# Altium schematic sheet power.SchDoc: Power Supply
size A3; DocumentNumber: 4; SheetNumber: 4; SheetTotal: 9
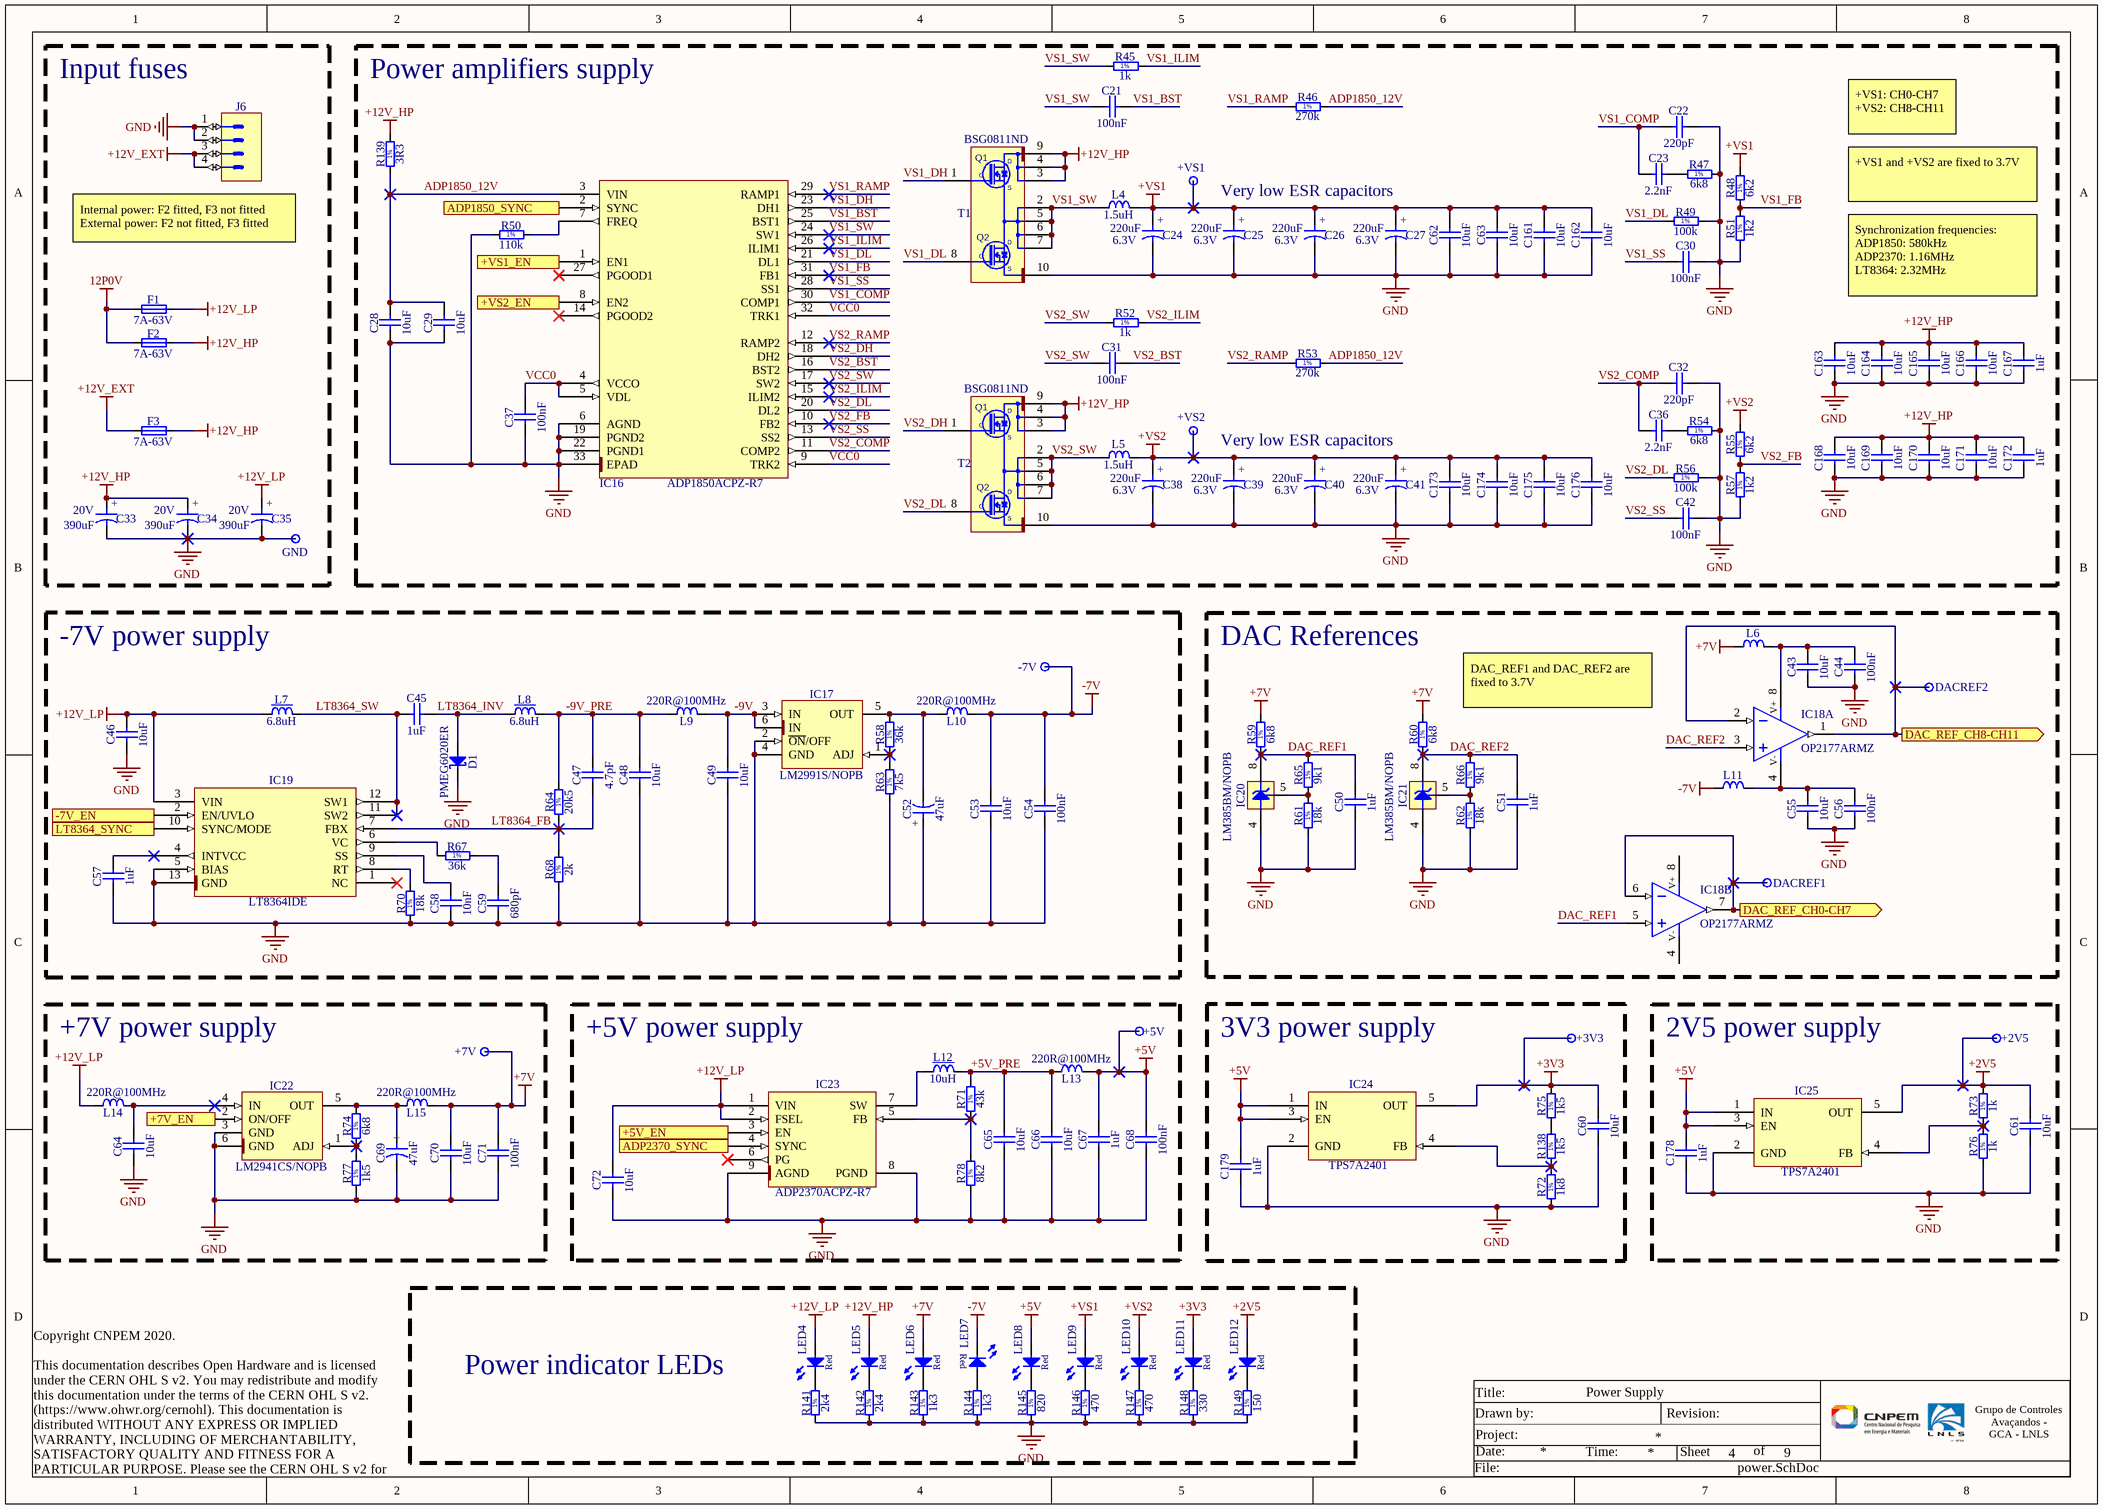
[diagram p0: power.SchDoc]

## Parts
+2V5  Test Point  [TPS127]  (value not drawn)
+3V3  Test Point  [TPS127]  (value not drawn)
+5V  Test Point  [TPS127]  (value not drawn)
+7V  Test Point  [TPS127]  (value not drawn)
+VS1  Test Point  [TPS127]  (value not drawn)
+VS2  Test Point  [TPS127]  (value not drawn)
-7V  Test Point  [TPS127]  (value not drawn)
C21  100nF  [CAPC1005X55N]
C22  220pF  [CAPC1005X55N]
C23  2.2nF  [CAPC1005X55N]
C24  220uF  Voltage: 6.3V  [CAPMP7343X310N]
C25  220uF  Voltage: 6.3V  [CAPMP7343X310N]
C26  220uF  Voltage: 6.3V  [CAPMP7343X310N]
C27  220uF  Voltage: 6.3V  [CAPMP7343X310N]
C28  10uF  [CAPC3216X180N]
C29  10uF  [CAPC3216X180N]
C30  100nF  [CAPC1005X55N]
C31  100nF  [CAPC1005X55N]
C32  220pF  [CAPC1005X55N]
C33  390uF  Voltage: 20V  [CAPAE830X1020N]
C34  390uF  Voltage: 20V  [CAPAE830X1020N]
C35  390uF  Voltage: 20V  [CAPAE830X1020N]
C36  2.2nF  [CAPC1005X55N]
C37  100nF  [CAPC1005X55N]
C38  220uF  Voltage: 6.3V  [CAPMP7343X310N]
C39  220uF  Voltage: 6.3V  [CAPMP7343X310N]
C40  220uF  Voltage: 6.3V  [CAPMP7343X310N]
C41  220uF  Voltage: 6.3V  [CAPMP7343X310N]
C42  100nF  [CAPC1005X55N]
C43  10uF  [CAPC2012X95N]
C44  100nF  [CAPC1608X87N]
C45  1uF  [CAPC2012X140N]
C46  10uF  [CAPC3216X180N]
C47  4.7pF  [CAPC1005X55N]
C48  10uF  [CAPC3216X180N]
C49  10uF  [CAPC3216X180N]
C50  1uF  [CAPC2012X135N]
C51  1uF  [CAPC2012X135N]
C52  47uF  [CAPMP7343X310N]
C53  10uF  [CAPC3216X180N]
C54  100nF  [CAPC1608X87N]
C55  10uF  [CAPC2012X95N]
C56  100nF  [CAPC1608X87N]
C57  1uF  [CAPC2012X140N]
C58  10nF  [CAPC1005X55N]
C59  680pF  [CAPC1005X55N]
C60  10uF  [CAPC2012X95N]
C61  10uF  [CAPC2012X95N]
C62  10uF  [CAPC3216X180N]
C63  10uF  [CAPC3216X180N]
C64  10uF  [CAPC3216X180N]
C65  10uF  [CAPC3216X180N]
C66  10uF  [CAPC3216X180N]
C67  1uF  [CAPC2012X135N]
C68  100nF  [CAPC1005X55N]
C69  47uF  [CAPMP7343X310N]
C70  10uF  [CAPC3216X180N]
C71  100nF  [CAPC1608X87N]
C72  10uF  [CAPC3216X180N]
C161  10uF  [CAPC3216X180N]
C162  10uF  [CAPC3216X180N]
C163  10uF  [CAPC3216X180N]
C164  10uF  [CAPC3216X180N]
C165  10uF  [CAPC3216X180N]
C166  10uF  [CAPC3216X180N]
C167  1uF  [CAPC2012X135N]
C168  10uF  [CAPC3216X180N]
C169  10uF  [CAPC3216X180N]
C170  10uF  [CAPC3216X180N]
C171  10uF  [CAPC3216X180N]
C172  1uF  [CAPC2012X135N]
C173  10uF  [CAPC3216X180N]
C174  10uF  [CAPC3216X180N]
C175  10uF  [CAPC3216X180N]
C176  10uF  [CAPC3216X180N]
C178  1uF  [CAPC2012X135N]
C179  1uF  [CAPC2012X135N]
D1  PMEG6020ER  [SODFL3517X110N]
DACREF1  Test Point  [TPS127]  (value not drawn)
DACREF2  Test Point  [TPS127]  (value not drawn)
F1  7A-63V  [FUSC_BEL_C1T_1206]
F2  7A-63V  [FUSC_BEL_C1T_1206]
F3  7A-63V  [FUSC_BEL_C1T_1206]
GND  Test Point  [TPS127]  (value not drawn)
IC16  ADP1850ACPZ-R7  [QFN50P500X500X100-33N-S325]
IC17  LM2991S/NOPB  [TO170P1435X465-6N-R1041X635]
IC18  OP2177ARMZ  [SOP65P490X110-8N]  (parts A,B of 2)
IC19  LT8364IDE  [DFN50P300X400-12N-1]
IC20  LM385BM/NOPB  [SOIC127P600X175-8N]
IC21  LM385BM/NOPB  [SOIC127P600X175-8N]
IC22  LM2941CS/NOPB  [TO170P1435X465-6N-R1041X635]
IC23  ADP2370ACPZ-R7  [SON50P300X300X80-9N-R170X244]
IC24  TPS7A2401  [SOT95P270X145-5N]
IC25  TPS7A2401  [SOT95P270X145-5N]
J6  Euroblock  [MOLEX_39502-1004]  (value not drawn)
L4  1.5uH  [IND_PULSE_PA4342_FP1]
L5  1.5uH  [IND_PULSE_PA4342_FP1]
L6  1K@100MHz  [INDC1608X95N]  (value not drawn)
L7  6.8uH  [IND_BOURNS_SRN5040TA]
L8  6.8uH  [IND_BOURNS_SRN5040TA]
L9  220R@100MHz  [INDC2012X105N]
L10  220R@100MHz  [INDC2012X105N]
L11  1K@100MHz  [INDC1608X95N]  (value not drawn)
L12  10uH  [IND_BOURNS_SRN5040TA]
L13  220R@100MHz  [INDC2012X105N]
L14  220R@100MHz  [INDC2012X105N]
L15  220R@100MHz  [INDC2012X105N]
LED4  Red  [LEDC1608X80N_RED]  (value not drawn)
LED5  Red  [LEDC1608X80N_RED]  (value not drawn)
LED6  Red  [LEDC1608X80N_RED]  (value not drawn)
LED7  Red  [LEDC1608X80N_RED]  (value not drawn)
LED8  Red  [LEDC1608X80N_RED]  (value not drawn)
LED9  Red  [LEDC1608X80N_RED]  (value not drawn)
LED10  Red  [LEDC1608X80N_RED]  (value not drawn)
LED11  Red  [LEDC1608X80N_RED]  (value not drawn)
LED12  Red  [LEDC1608X80N_RED]  (value not drawn)
R45  1k  [RESC1005X40N]
R46  270k  [RESC1005X40N]
R47  6k8  [RESC1005X40N]
R48  6k2  [RESC2012X60N]
R49  100k  [RESC1005X40N]
R50  110k  [RESC1005X40N]
R51  1k2  [RESC2012X60N]
R52  1k  [RESC1005X40N]
R53  270k  [RESC1005X40N]
R54  6k8  [RESC1005X40N]
R55  6k2  [RESC2012X60N]
R56  100k  [RESC1005X40N]
R57  1k2  [RESC2012X60N]
R58  36k  [RESC1005X40N]
R59  6k8  [RESC1005X40N]
R60  6k8  [RESC1005X40N]
R61  18k  [RESC2012X60N]
R62  18k  [RESC2012X60N]
R63  7k5  [RESC1005X40N]
R64  20k5  [RESC1005X40N]
R65  9k1  [RESC2012X60N]
R66  9k1  [RESC2012X60N]
R67  36k  [RESC1005X40N]
R68  2k  [RESC1005X40N]
R70  18k  [RESC1005X40N]
R71  43k  [RESC1005X40N]
R72  1k8  [RESC1005X40N]
R73  1k  [RESC1005X40N]
R74  6k8  [RESC1005X40N]
R75  1k5  [RESC1005X40N]
R76  1k  [RESC1005X40N]
R77  1k5  [RESC1005X40N]
R78  8k2  [RESC1005X40N]
R138  1k5  [RESC1005X40N]
R139  3R3  [RESC2012X60N]
R141  2k4  [RESC1005X40N]
R142  2k4  [RESC1005X40N]
R143  1k3  [RESC1005X40N]
R144  1k3  [RESC1005X40N]
R145  820  [RESC1005X40N]
R146  470  [RESC1005X40N]
R147  470  [RESC1005X40N]
R148  330  [RESC1005X40N]
R149  150  [RESC1005X40N]
T1  BSG0811ND  [PG-TISON8-4]
T2  BSG0811ND  [PG-TISON8-4]

## Blocks framed on the sheet
Input fuses: C33-C35 F1-F3 GND J6
Power amplifiers supply: +VS1 +VS2 C21-C32 C36-C42 C62 C63 C161-C176 IC16 L4 L5 R45-R57 R139 T1 T2
-7V power supply: -7V C45-C49 C52-C54 C57-C59 D1 IC17 IC19 L7-L10 R58 R63 R64 R67 R68 R70
DAC References: C43 C44 C50 C51 C55 C56 DACREF1 DACREF2 IC18 IC20 IC21 L6 L11 R59-R62 R65 R66
+7V power supply: +7V C64 C69-C71 IC22 L14 L15 R74 R77
+5V power supply: +5V C65-C68 C72 IC23 L12 L13 R71 R78
3V3 power supply: +3V3 C60 C179 IC24 R72 R75 R138
2V5 power supply: +2V5 C61 C178 IC25 R73 R76
Power indicator LEDs: LED4-LED12 R141-R149

## Ports
+5V_EN (in), +7V_EN (in), +VS1_EN (in), +VS2_EN (in), -7V_EN (in), ADP1850_SYNC (in), ADP2370_SYNC (in), DAC_REF_CH0-CH7 (out), DAC_REF_CH8-CH11 (out), LT8364_SYNC (in)

## Nets
12P0V: F1.1 F2.1
+2V5: +2V5.1 C61.2 IC25.5(OUT) LED12.2(A) R73.2
+3V3: +3V3.1 C60.2 IC24.5(OUT) LED11.2(A) R75.2
+5V: +5V.1 C67.2 C68.2 C178.2 C179.2 IC24.1(IN) IC24.3(EN) IC25.1(IN) IC25.3(EN) L13.2 LED8.2(A)
+7V: +7V.1 C70.2 C71.2 L6.1 L15.2 LED6.2(A) R59.2 R60.2
+12V_EXT: F3.1 J6.3 J6.4
+12V_HP: C33.1 C34.1 C163.2 C164.2 C165.2 C166.2 C167.2 C168.2 C169.2 C170.2 C171.2 C172.2 F2.2 F3.2 LED5.2(A) R139.2 T1.3(D1) T1.4(S2) T1.9(D1) T2.3(D1) T2.4(S2) T2.9(D1)
+12V_LP: C35.1 C46.2 C72.2 F1.2 IC19.3(VIN) IC23.1(VIN) IC23.2(FSEL) L7.1 L14.1 LED4.2(A)
+VS1: +VS1.1 C24.1 C25.1 C26.1 C27.1 C62.2 C63.2 C161.2 C162.2 L4.2 LED9.2(A) R48.2
+VS2: +VS2.1 C38.1 C39.1 C40.1 C41.1 C173.2 C174.2 C175.2 C176.2 L5.2 LED10.2(A) R55.2
-7V: -7V.1 C53.2 C54.2 L10.2 L11.1 LED7.1(C)
GND: C22.2 C24.2 C25.2 C26.2 C27.2 C28.1 C29.1 C30.2 C32.2 C33.2 C34.2 C35.2 C37.1 C38.2 C39.2 C40.2 C41.2 C42.2 C43.1 C44.1 C46.1 C48.1 C49.1 C50.1 C51.1 C52.1 C53.1 C54.1 C55.1 C56.1 C57.1 C58.1 C59.1 C60.1 C61.1 C62.1 C63.1 C64.1 C65.1 C66.1 C67.1 C68.1 C69.2 C70.1 C71.1 C72.1 C161.1 C162.1 C163.1 C164.1 C165.1 C166.1 C167.1 C168.1 C169.1 C170.1 C171.1 C172.1 C173.1 C174.1 C175.1 C176.1 C178.1 C179.1 D1.1(C) GND.1 IC16.6(AGND) IC16.19(PGND2) IC16.22(PGND1) IC16.33(EPAD) IC17.2(~{ON}/OFF) IC17.4(GND) IC19.5(BIAS) IC19.13(GND) IC20.4(A) IC21.4(A) IC22.3(GND) IC22.6(GND) IC23.8(PGND) IC23.9(AGND) IC24.2(GND) IC25.2(GND) J6.1 J6.2 R47.2 R49.2 R50.1 R51.1 R54.2 R56.2 R57.1 R61.1 R62.1 R63.1 R68.1 R70.1 R72.1 R76.1 R77.1 R78.1 R141.1 R142.1 R143.1 R144.1 R145.1 R146.1 R147.1 R148.1 R149.1 T1.10(S2) T2.10(S2)
+5V_EN: IC23.3(EN) ; port +5V_EN
+5V_PRE: C65.2 C66.2 L12.2 L13.1 R71.2
+7V_EN: IC22.2(ON/OFF) ; port +7V_EN
+VS1_EN: IC16.1(EN1) ; port +VS1_EN
+VS2_EN: IC16.8(EN2) ; port +VS2_EN
-7V_EN: IC19.2(EN/UVLO) ; port -7V_EN
-9V: C49.2 IC17.3(IN) IC17.6(IN) L9.2
-9V_PRE: C47.2 C48.2 L8.2 L9.1 R64.2
ADP1850_12V: C28.2 C29.2 IC16.3(VIN) R46.2 R53.2 R139.1
ADP1850_SYNC: IC16.2(SYNC) ; port ADP1850_SYNC
ADP2370_SYNC: IC23.4(SYNC) ; port ADP2370_SYNC
DAC_REF1: C50.2 IC18.5(IN+) IC20.8(C) R59.1 R65.2
DAC_REF2: C51.2 IC18.3(IN+) IC21.8(C) R60.1 R66.2
DAC_REF_CH0-CH7: DACREF1.1 IC18.6(IN-) IC18.7(OUT) ; port DAC_REF_CH0-CH7
DAC_REF_CH8-CH11: DACREF2.1 IC18.1(OUT) IC18.2(IN-) ; port DAC_REF_CH8-CH11
LT8364_FB: C47.1 IC19.7(FBX) R64.1 R68.2
LT8364_INV: C45.2 D1.2(A) L8.1
LT8364_SW: C45.1 IC19.11(SW2) IC19.12(SW1) L7.2
LT8364_SYNC: IC19.10(SYNC/MODE) ; port LT8364_SYNC
VCC0: C37.2 IC16.4(VCCO) IC16.5(VDL) IC16.9(TRK2) IC16.32(TRK1)
VS1_BST: C21.2 IC16.25(BST1)
VS1_COMP: C22.1 C23.1 IC16.30(COMP1)
VS1_DH: IC16.23(DH1) T1.1(G1)
VS1_DL: IC16.21(DL1) R49.1 T1.8(G2)
VS1_FB: IC16.31(FB1) R48.1 R51.2
VS1_ILIM: IC16.26(ILIM1) R45.2
VS1_RAMP: IC16.29(RAMP1) R46.1
VS1_SS: C30.1 IC16.28(SS1)
VS1_SW: C21.1 IC16.24(SW1) L4.1 R45.1 T1.2(D1) T1.5(D1) T1.6(S1D2) T1.7(S2)
VS2_BST: C31.2 IC16.16(BST2)
VS2_COMP: C32.1 C36.1 IC16.11(COMP2)
VS2_DH: IC16.18(DH2) T2.1(G1)
VS2_DL: IC16.20(DL2) R56.1 T2.8(G2)
VS2_FB: IC16.10(FB2) R55.1 R57.2
VS2_ILIM: IC16.15(ILIM2) R52.2
VS2_RAMP: IC16.12(RAMP2) R53.1
VS2_SS: C42.1 IC16.13(SS2)
VS2_SW: C31.1 IC16.17(SW2) L5.1 R52.1 T2.2(D1) T2.5(D1) T2.6(S1D2) T2.7(S2)
NetC23_2: C23.2 R47.1
NetC36_2: C36.2 R54.1
NetC43_2: C43.2 C44.2 IC18.8(V+) L6.2
NetC52_2: C52.2 IC17.5(OUT) L10.1 R58.2
NetC55_2: C55.2 C56.2 IC18.4(V-) L11.2
NetC57_2: C57.2 IC19.4(INTVCC)
NetC58_2: C58.2 IC19.9(SS)
NetC59_2: C59.2 R67.2
NetC64_2: C64.2 IC22.4(IN) L14.2
NetC69_1: C69.1 IC22.5(OUT) L15.1 R74.2
NetIC16_7: IC16.7(FREQ) R50.2
NetIC17_1: IC17.1(ADJ) R58.1 R63.2
NetIC19_6: IC19.6(VC) R67.1
NetIC19_8: IC19.8(RT) R70.2
NetIC20_5: IC20.5(Adj) R61.2 R65.1
NetIC21_5: IC21.5(Adj) R62.2 R66.1
NetIC22_1: IC22.1(ADJ) R74.1 R77.2
NetIC23_5: IC23.5(FB) R71.1 R78.2
NetIC23_7: IC23.7(SW) L12.1
NetIC24_4: IC24.4(FB) R72.2 R138.1
NetIC25_4: IC25.4(FB) R73.1 R76.2
NetLED4_1: LED4.1(C) R141.2
NetLED5_1: LED5.1(C) R142.2
NetLED6_1: LED6.1(C) R143.2
NetLED7_2: LED7.2(A) R144.2
NetLED8_1: LED8.1(C) R145.2
NetLED9_1: LED9.1(C) R146.2
NetLED10_1: LED10.1(C) R147.2
NetLED11_1: LED11.1(C) R148.2
NetLED12_1: LED12.1(C) R149.2
NetR75_1: R75.1 R138.2

Not connected (* = marked no-connect by the designer): IC16 14(PGOOD2)* 27(PGOOD1)*; IC19 1(NC)*; IC23 6(PG)*

## Notes on the sheet
- +VS1: CH0-CH7
  +VS2: CH8-CH11
- (near J6) Internal power: F2 fitted, F3 not fitted
  External power: F2 not fitted, F3 fitted
- Very low ESR capacitors
- +VS1 and +VS2 are fixed to 3.7V
- Synchronization frequencies:
  ADP1850: 580kHz
  ADP2370: 1.16MHz
  LT8364: 2.32MHz
- DAC_REF1 and DAC_REF2 are fixed to 3.7V
- Title:
- Date:
- Project:
- Drawn by:
- Time:
- Revision:
- Sheet
- of
- Grupo de Controles Avaçandos -
  GCA - LNLS
- Copyright CNPEM 2020.
  This documentation describes Open Hardware and is licensed under the CERN OHL S v2. You may redistribute and modify this documentation under the terms of the CERN OHL S v2. (https://www.ohwr.org/cernohl). This documentation is distributed WITHOUT ANY EXPRESS OR IMPLIED WARRANTY, INCLUDING OF MERCHANTABILITY, SATISFACTORY QUALITY AND FITNESS FOR A PARTICULAR PURPOSE. Please see the CERN OHL S v2 for applicable conditions.
- File:
- (in symbol BSG0811ND) D; Q1; G; S; Q2
- (in symbol CAE830-1020_390UF_20V_20%_20SVPF390M) +
- (in symbol R0402_1K3_1%_0.0625W_100PPM) 1%
- (in symbol R0402_1K5_1%_0.0625W_100PPM) 1%
- (in symbol R0402_1K8_1%_0.0625W_100PPM) 1%
- (in symbol R0402_1K_1%_0.0625W_100PPM) 1%
- (in symbol R0402_2K4_1%_0.0625W_100PPM) 1%
- (in symbol R0402_2K_1%_0.0625W_100PPM) 1%
- (in symbol R0402_6K8_1%_0.0625W_100PPM) 1%
- (in symbol R0402_7K5_1%_0.0625W_100PPM) 1%
- (in symbol R0402_8K2_1%_0.0625W_100PPM) 1%
- (in symbol R0402_18K_1%_0.0625W_100PPM) 1%
- (in symbol R0402_20K5_1%_0.0625W_100PPM) 1%
- (in symbol R0402_36K_1%_0.0625W_100PPM) 1%
- (in symbol R0402_43K_1%_0.0625W_100PPM) 1%
- (in symbol R0402_100K_1%_0.0625W_100PPM) 1%
- (in symbol R0402_110K_1%_0.0625W_100PPM) 1%
- (in symbol R0402_150R_1%_0.0625W_100PPM) 1%
- (in symbol R0402_270K_1%_0.0625W_100PPM) 1%
- (in symbol R0402_330R_1%_0.0625W_100PPM) 1%
- (in symbol R0402_470R_1%_0.0625W_100PPM) 1%
- (in symbol R0402_820R_1%_0.0625W_100PPM) 1%
- (in symbol R0805_1K2_1%_0.125W_100PPM) 1%
- (in symbol R0805_3R3_1%_0.125W_200PPM) 1%
- (in symbol R0805_6K2_1%_0.125W_100PPM) 1%
- (in symbol R0805_9K1_1%_0.125W_100PPM) 1%
- (in symbol R0805_18K_1%_0.125W_100PPM) 1%
- (in symbol TANT_47uF_25V_20%_AVX_TCJD476M025R0100E) +
- (in symbol TANT_220uF_6.3V_20%_KEMET_T520D227M006ATE009) +

## Library data of the parts
+2V5 +3V3 +5V +7V +VS1 +VS2 -7V DACREF1 DACREF2 GND = SMD_PAD_1.27X1.27MM: 1.27mm x 1.27mm PCB Copper Area (SMD Test Point); Mounted: No; Part Number: SMD_PAD_1.27X1.27MM; Component Kind: Standard (No BOM); Component Type: Standard (No BOM); Pin Count: 1; Family: Test Point; Socket: No; SMD: Yes; Sense: No; Status: None; ComponentHeight: 0mm; HelpURL: Undefined; Author: CERN DEM JLC; CreateDate: 12/01/2008; LatestRevisionDate: 12/01/2008; PackageDescription: 1.27mm x 1.27mm PCB Copper Area (SMD Test Point)
C21 C30 C31 C37 C42 C68 = CC0402_100NF_16V_10%_X7R: SMD Multilayer Chip Ceramic Capacitor; Manufacturer: GENERIC; Manufacturer1 Part Number: GRM155R71C104KA88D; Voltage: 16V; TC: X7R; Tolerance: ±10%; Part Number: CC0402_100NF_16V_10%_X7R; Component Kind: Standard; Component Type: Standard; Pin Count: 2; Value: 100nF; Status: Not Recommended; Manufacturer Part Number: CC0402_100NF_16V_10%_X7R; Case: 0402; Mounted: Yes; Socket: No; SMD: Yes; Sense: No; Manufacturer1 Example: MURATA; Manufacturer1 ComponentHeight: 0.55mm; HelpURL: \\cern.ch\dfs\Applications\Altium\Datasheets\CC0402_X7R_MURATA_GRM.pdf; Author: CERN DEM JLC; CreateDate: 05/12/2013; LatestRevisionDate: 03/12/2007
C22 C32 = CC0402_220PF_50V_5%_C0G: SMD Multilayer Chip Ceramic Capacitor; Manufacturer: GENERIC; Manufacturer1 Part Number: C0402C221J5GACTU; Voltage: 50V; TC: C0G/NP0; Tolerance: ±5%; Part Number: CC0402_220PF_50V_5%_C0G; Component Kind: Standard; Component Type: Standard; Pin Count: 2; Value: 220pF; Status: Preferred; Manufacturer Part Number: CC0402_220PF_50V_5%_C0G; Case: 0402; Mounted: Yes; Socket: No; SMD: Yes; Sense: No; Manufacturer1 Example: KEMET; Manufacturer1 ComponentHeight: 0.55mm; HelpURL: \\cern.ch\dfs\Applications\Altium\Datasheets\CC0805_C0G_KEMET_(Commercial Grade).pdf; Author: CERN DEM JLC; CreateDate: 03/12/2007; LatestRevisionDate: 22/04/2015
C23 C36 = CC0402_2.2NF_50V_10%_X7R: SMD Multilayer Chip Ceramic Capacitor; Manufacturer: GENERIC; Manufacturer1 Part Number: 223858715627; Voltage: 50V; TC: X7R; Tolerance: ±10%; Part Number: CC0402_2.2NF_50V_10%_X7R; Component Kind: Standard; Component Type: Standard; Pin Count: 2; Value: 2.2nF; Status: Not Recommended; Manufacturer Part Number: CC0402_2.2NF_50V_10%_X7R; Case: 0402; Mounted: Yes; Socket: No; SMD: Yes; Sense: No; Manufacturer1 Example: PHYCOMP; Manufacturer1 ComponentHeight: 0.55mm; HelpURL: \\cern.ch\dfs\Applications\Altium\Datasheets\CC0402_X7R_PHYCOMP.pdf; Author: CERN DEM JLC; CreateDate: 03/12/2007; LatestRevisionDate: 03/12/2007
C24-C27 C38-C41 = TANT_220uF_6.3V_20%_KEMET_T520D227M006ATE009: Low ESR (9 mOhms) Organic Polymer Tantalum Capacitor (7343 Size); Manufacturer: Kemet; Tolerance: ±20%; Part Number: TANT_220uF_6.3V_20%_KEMET_T520D227M006ATE009; Component Kind: Standard; Component Type: Standard; Pin Count: 2; Value: 220uF; Status: None; Manufacturer Part Number: T520D227M006ATE009; Case: 7343; Mounted: Yes; Socket: No; SMD: Yes; Sense: No; ComponentHeight: 3mm; Author: LNLS DIG AFG; CreateDate: 21/05/2020; LatestRevisionDate: 21/05/2020
C28 C29 C46 C48 C49 C53 C62-C66 C70 C72 C161-C166 C168-C171 C173-C176 = CC1206_10UF_25V_10%_X7R: SMD Multilayer Chip Ceramic Capacitor; Manufacturer: GENERIC; Manufacturer1 Part Number: C1206C106K4RACTU; Voltage: 25V; TC: X7R; Tolerance: ±10%; Part Number: CC1206_10UF_25V_10%_X7R; Component Kind: Standard; Component Type: Standard; Pin Count: 2; Value: 10uF; Status: Preferred; Manufacturer Part Number: CC1206_10uF_25V_10%_X7R; Case: 1206; Mounted: Yes; Socket: No; SMD: Yes; Sense: No; Manufacturer1 Example: KEMET; Manufacturer1 ComponentHeight: 1.8mm; HelpURL: \\cern.ch\dfs\Applications\Altium\Datasheets\CC1206_X7R_KEMET.pdf; Author: CERN DEM JLC; CreateDate: 12/09/2012; LatestRevisionDate: 12/09/2012
C33-C35 = CAE830-1020_390UF_20V_20%_20SVPF390M: Low ESR (14 mOhms)  Aluminum Electrolytic Capacitors; Manufacturer: Panasonic; Tolerance: ±20%; Part Number: CAE830-1020_390UF_20V_20%_20SVPF390M; Component Kind: Standard; Component Type: Standard; Pin Count: 2; Value: 390uF; Status: None; Manufacturer Part Number: 20SVPF390M; Case: E12; Mounted: Yes; Socket: No; SMD: Yes; Sense: No; ComponentHeight: 12mm; Author: LNLS DIG AFG; CreateDate: 30/09/2021; LatestRevisionDate: 30/09/2021
C43 C55 C60 C61 = CC0805_10UF_25V_10%_X5R: SMD Multilayer Chip Ceramic Capacitor; Manufacturer: GENERIC; Manufacturer1 Part Number: GRM219R61E106KA12D; Voltage: 25V; TC: X5R; Tolerance: ±10%; Part Number: CC0805_10UF_25V_10%_X5R; Component Kind: Standard; Component Type: Standard; Pin Count: 2; Value: 10uF; Status: Preferred; Manufacturer Part Number: CC0805_10UF_25V_10%_X5R; Case: 0805; Mounted: Yes; Socket: No; SMD: Yes; Sense: No; Manufacturer1 Example: MURATA; Manufacturer1 ComponentHeight: 0.95mm; HelpURL: \\cern.ch\dfs\Applications\Altium\Datasheets\CC0805_X5R_MURATA_GRM.pdf; Author: CERN DEM JLC; CreateDate: 25/10/2012; LatestRevisionDate: 06/09/2016
C44 C54 C56 C71 = CC0603_100NF_50V_10%_X7R: SMD Multilayer Chip Ceramic Capacitor; Manufacturer: GENERIC; Manufacturer1 Part Number: 223858615649; Voltage: 50V; TC: X7R; Tolerance: ±10%; Part Number: CC0603_100NF_50V_10%_X7R; Component Kind: Standard; Component Type: Standard; Pin Count: 2; Value: 100nF; Status: Preferred; Manufacturer Part Number: CC0603_100NF_50V_10%_X7R; Case: 0603; Mounted: Yes; Socket: No; SMD: Yes; Sense: No; Manufacturer1 Example: PHYCOMP; Manufacturer1 ComponentHeight: 0.87mm; HelpURL: \\cern.ch\dfs\Applications\Altium\Datasheets\CC0603_X7R_PHYCOMP.pdf; Author: CERN DEM JLC; CreateDate: 03/12/2007; LatestRevisionDate: 03/12/2007
C45 C57 = CC0805_1UF_25V_10%_X7R: SMD Multilayer Chip Ceramic Capacitor; Manufacturer: GENERIC; Manufacturer1 Part Number: C0805C105K3RAC; Voltage: 25V; TC: X7R; Tolerance: ±10%; Part Number: CC0805_1UF_25V_10%_X7R; Component Kind: Standard; Component Type: Standard; Pin Count: 2; Value: 1uF; Status: Preferred; Manufacturer Part Number: CC0805_1UF_25V_10%_X7R; Case: 0805; Mounted: Yes; Socket: No; SMD: Yes; Sense: No; Manufacturer1 Example: KEMET; Manufacturer1 ComponentHeight: 1.4mm; HelpURL: \\cern.ch\dfs\Applications\Altium\Datasheets\CC0805_X7R_KEMET.pdf; Author: CERN DEM JLC; CreateDate: 23/03/2009; LatestRevisionDate: 23/03/2009
C47 = CC0402_4.7PF_50V_0.25PF_C0G: SMD Multilayer Chip Ceramic Capacitor; Manufacturer: GENERIC; Manufacturer1 Part Number: C0402C479C5GACTU; Voltage: 50V; TC: C0G/NP0; Tolerance: ±0.25pF; Part Number: CC0402_4.7PF_50V_0.25PF_C0G; Component Kind: Standard; Component Type: Standard; Pin Count: 2; Value: 4.7pF; Status: Preferred; Manufacturer Part Number: CC0402_4.7PF_50V_0.25PF_C0G; Case: 0402; Mounted: Yes; Socket: No; SMD: Yes; Sense: No; Manufacturer1 Example: KEMET; Manufacturer1 ComponentHeight: 0.55mm; HelpURL: \\cern.ch\dfs\Applications\Altium\Datasheets\CC0805_C0G_KEMET_(Commercial Grade).pdf; Author: CERN DEM JLC; CreateDate: 03/12/2007; LatestRevisionDate: 22/04/2015
C50 C51 C67 C167 C172 C178 C179 = CC0805_1UF_16V_10%_X7R: SMD Multilayer Chip Ceramic Capacitor; Manufacturer: GENERIC; Manufacturer1 Part Number: C2012X7R1C105K125AA; Voltage: 16V; TC: X7R; Tolerance: ±10%; Part Number: CC0805_1UF_16V_10%_X7R; Component Kind: Standard; Component Type: Standard; Pin Count: 2; Value: 1uF; Status: Preferred; Manufacturer Part Number: CC0805_1UF_16V_10%_X7R; Case: 0805; Mounted: Yes; Socket: No; SMD: Yes; Sense: No; Manufacturer1 Example: TDK; Manufacturer1 ComponentHeight: 1.45mm; HelpURL: \\cern.ch\dfs\Applications\Altium\Datasheets\CC0805_X7R_TDK_C.pdf; Author: CERN DEM JLC; CreateDate: 03/12/2007; LatestRevisionDate: 22/04/2015
C52 C69 = TANT_47uF_25V_20%_AVX_TCJD476M025R0100E: Low ESR (100 mOhms) Organic Polymer Tantalum Capacitor (7343 Size); Manufacturer: AVX; Voltage: 25V; Tolerance: ±20%; Part Number: TANT_47uF_25V_20%_AVX_TCJD476M025R0100E; Component Kind: Standard; Component Type: Standard; Pin Count: 2; Value: 47uF; Status: None; Manufacturer Part Number: TCJD476M025R0100E; Case: 7343; Mounted: Yes; Socket: No; SMD: Yes; Sense: No; ComponentHeight: 3mm; Author: LNLS DIG AFG; CreateDate: 16/07/2020; LatestRevisionDate: 16/07/2020
C58 = CC0402_10NF_25V_10%_X7R: SMD Multilayer Chip Ceramic Capacitor; Manufacturer: GENERIC; Manufacturer1 Part Number: C1005X7R1E103KT; Voltage: 25V; TC: X7R; Tolerance: ±10%; Part Number: CC0402_10NF_25V_10%_X7R; Component Kind: Standard; Component Type: Standard; Pin Count: 2; Value: 10nF; Status: Preferred; Manufacturer Part Number: CC0402_10NF_25V_10%_X7R; Case: 0402; Mounted: Yes; Socket: No; SMD: Yes; Sense: No; Manufacturer1 Example: TDK; Manufacturer1 ComponentHeight: 0.55mm; HelpURL: \\cern.ch\dfs\Applications\Altium\Datasheets\CC0402_X7R_TDK_C.pdf; Author: CERN DEM JLC; CreateDate: 25/10/2012; LatestRevisionDate: 25/10/2012
C59 = CC0402_680PF_50V_5%_X7R: SMD Multilayer Chip Ceramic Capacitor; Manufacturer: GENERIC; Manufacturer Part Number: CC0402_680PF_50V_10%_X7R; Manufacturer1 Part Number: 223858715621; Voltage: 50V; TC: X7R; Tolerance: ±10%; Part Number: CC0402_680PF_50V_5%_X7R; Component Kind: Standard; Component Type: Standard; Pin Count: 2; Value: 680pF; Status: Not Recommended; Case: 0402; Mounted: Yes; Socket: No; SMD: Yes; Sense: No; Manufacturer1 Example: PHYCOMP; Manufacturer1 ComponentHeight: 0.55mm; HelpURL: \\cern.ch\dfs\Applications\Altium\Datasheets\CC0402_NP0_PHYCOMP.pdf; Author: CERN DEM JLC; CreateDate: 03/12/2007; LatestRevisionDate: 03/12/2007
D1 = PMEG6020ER: MEGA Schottky Barrier Rectifier; Manufacturer: NXP SEMICONDUCTORS; Voltage: 60V; Power: 2A; PressFit: No; Bonding: No; Part Number: PMEG6020ER; Component Kind: Standard; Component Type: Standard; Device: PMEG6020ER; PackageDescription: SODFL Diode (SOD123W); 2.60mm W X 1.70mm L X 1.10mm H body, IPC Medium Density; Manufacturer Part Number: PMEG6020ER; Pin Count: 2; Case: SOD123; Mounted: Yes; Socket: No; SMD: Yes; Sense: No; ComponentHeight: 0.65mm; HelpURL: \\cern.ch\dfs\Applications\Altium\Datasheets\PMEG6020ER.pdf; Author: CERN DEM JMW; CreateDate: 19/06/2014; LatestRevisionDate: 19/06/2014
F1-F3 = FUSE_BEL_0685T7000-01: 7A, 63VDC, 1206 size, Surface Mount Fuses Surface Mt Slow Blow; Manufacturer: BEL; PressFit: No; Part Number: FUSE_BEL_0685T7000-01; Component Kind: Standard; Component Type: Standard; Pin Count: 2; Case: 1206; PackageDescription: Surface Mount Slow Blow Chip Fuse, C1T Series; Family: Fuse; Mounted: Yes; Socket: No; SMD: Yes; Sense: No; Value: 7A-63V; Manufacturer Part Number: 0685T7000-01; ComponentHeight: 0.63mm; Author: LNLS DIG AFG; CreateDate: 04/06/2020; LatestRevisionDate: 04/06/2020
IC16 = ADP1850ACPZ-R7: Wide Range Input, Dual/Tow-Pahse, DC-to-DC Synchronous Buck Controller; Manufacturer: Analog Devices; PressFit: No; Bonding: No; Part Number: ADP1850ACPZ-R7; Component Kind: Standard; Component Type: Standard; Device: ADP1850ACPZ-R7; PackageDescription: QFN, 0.5mm pitch; 33 pin,  5.00mm W X 5.00mm L, IPC Medium Density; Manufacturer Part Number: ADP1850ACPZ-R7; Pin Count: 33; Case: QFN; Mounted: Yes; Socket: No; SMD: Yes; Sense: No; ComponentHeight: 5mm; HelpURL: https://www.analog.com/media/en/technical-documentation/data-sheets/ADP1850.pdf; Author: LNLS DIG AFG; CreateDate: 19/05/2020; LatestRevisionDate: 19/05/2020
IC17 = LM2991S/NOPB: -3V to -24V, 1A Negative Low Dropout Adjustable Regulator; Manufacturer: TEXAS INSTRUMENTS; PressFit: No; Bonding: No; Part Number: LM2991S/NOPB; Component Kind: Standard; Component Type: Standard; Device: LM2991S/NOPB; PackageDescription: TO-263, 5 Leads, 1.70mm pitch; TO, 14.35mm L X 8.64mm W X 4.65mm H body IPC Medium Density; Manufacturer Part Number: LM2991S/NOPB; Pin Count: 6; Case: TO-263; Mounted: Yes; Socket: No; SMD: Yes; Sense: No; ComponentHeight: 4.65mm; HelpURL: \\cern.ch\dfs\Applications\Altium\Datasheets\LM2991S-NOPB.pdf; Author: CERN DEM JLC; CreateDate: 09/03/2011; LatestRevisionDate: 16/09/2014
IC18 = OP2177ARMZ: Dual, Precision Low Noise, Low Input Bias Current Operational Amplifiers; Manufacturer: ANALOG DEVICES; PressFit: No; Bonding: No; Part Number: OP2177ARMZ; Component Kind: Standard; Component Type: Standard; Device: OP2177ARMZ; PackageDescription: SOP, 0.65mm pitch; 8 pin, 3.00mm W X 3.00mm L X 1.10mm H body, IPC Medium Density; Manufacturer Part Number: OP2177ARMZ; Pin Count: 8; Case: MSOP8; Mounted: Yes; Socket: No; SMD: Yes; Sense: No; ComponentHeight: 1.1mm; Author: LNLS DIG AFG; CreateDate: 11/06/2020; LatestRevisionDate: 11/06/2020
IC19 = LT8364IDE: Synchronous Low IQ Boost/SEPIC/Inverting Converter with 4A, 60V Switch; Manufacturer: Analog Devices; PressFit: No; Bonding: No; Part Number: LT8364IDE; Component Kind: Standard; Component Type: Standard; Device: LT8364IDE; PackageDescription: DFN, 0.5mm pitch; 11 pin,  3.00mm W X 4.00mm L, IPC Medium Density; Manufacturer Part Number: LT8364IDE; Pin Count: 13; Case: DFN; Mounted: Yes; Socket: No; SMD: Yes; Sense: No; ComponentHeight: 1mm; Author: LNLS GCA AFG; CreateDate: 01/10/2021; LatestRevisionDate: 01/10/2021
IC20 IC21 = LM385BM/NOPB: 1.24V to 5.30V Adjustable Micropower Voltage Reference; Manufacturer: TEXAS INSTRUMENTS; PressFit: No; Bonding: No; Part Number: LM385BM/NOPB; Component Kind: Standard; Component Type: Standard; Device: LM385BM/NOPB; PackageDescription: SOIC 8, Pitch 1.27mm, Body 4x5mm, IPC Medium Density; Manufacturer Part Number: LM385BM/NOPB; Pin Count: 8; Case: SOIC8; Mounted: Yes; Socket: No; SMD: Yes; Sense: No; ComponentHeight: 1.75mm; HelpURL: \\cern.ch\dfs\Applications\Altium\Datasheets\LM385BM-NOPB.pdf; Author: CERN DEM JLC; CreateDate: 24/03/2015; LatestRevisionDate: 24/03/2015
IC22 = LM2941CS/NOPB: 5V to 20V, 1A Low Dropout Adjustable Regulator; Manufacturer: TEXAS INSTRUMENTS; PressFit: No; Bonding: No; Part Number: LM2941CS/NOPB; Component Kind: Standard; Component Type: Standard; Device: LM2941CS/NOPB; PackageDescription: TO-263, 5 Leads, 1.70mm pitch; TO, 14.35mm L X 8.64mm W X 4.65mm H body IPC Medium Density; Manufacturer Part Number: LM2941CS/NOPB; Pin Count: 6; Case: TO-263; Mounted: Yes; Socket: No; SMD: Yes; Sense: No; ComponentHeight: 4.65mm; HelpURL: \\cern.ch\dfs\Applications\Altium\Datasheets\LM2941CS-NOPB.pdf; Author: CERN DEM JLC; CreateDate: 09/03/2011; LatestRevisionDate: 16/09/2014
IC23 = ADP2370ACPZ-R7: Synchronous 1.2 MHz/600 kHz, 800 mA, Low Quiescent Current Buck Regulator; Manufacturer: Analog Devices; PressFit: No; Bonding: No; Part Number: ADP2370ACPZ-R7; Component Kind: Standard; Component Type: Standard; Device: ADP2370ACPZ-R7; PackageDescription: SON, 0.5mm pitch; 9 pin, 3mm W X 3mm L X 0.8mm H body, IPC Medium Densisty; Manufacturer Part Number: ADP2370ACPZ-R7; Pin Count: 9; Case: SON8; Mounted: Yes; Socket: No; SMD: Yes; Sense: No; ComponentHeight: 0.8mm; Author: LNLS DIG AFG; CreateDate: 01/06/2020; LatestRevisionDate: 01/06/2020
IC24 IC25 = TPS7A2401: 200-mA, 18-V, Ultra-Low IQ, Low-Dropout Voltage Regulator, Adjustable; Manufacturer: TEXAS INSTRUMENTS; Manufacturer Part Number: TPS7A2401DBVR; PressFit: No; Bonding: No; Part Number: TPS7A2401; Component Kind: Standard; Component Type: Standard; Device: TPS7A2401; PackageDescription: SOT, 0.95mm Pitch; 5 Pin,1.55mm W X 2.90mm L X 1.45mm H body, IPC Medium Density; Pin Count: 5; Case: SOT23-5; Mounted: Yes; Socket: No; SMD: Yes; Sense: No; ComponentHeight: 1.25mm; Author: LNLS DIG AFG; CreateDate: 08/02/2021; LatestRevisionDate: 08/02/2021
J6 = MOLEX_39502-1004: 3.50mm Pitch Eurostyle Horizontal PCB Header, 4 Circuits; Manufacturer: MOLEX; Manufacturer Part Number: 395021004; PressFit: No; Part Number: MOLEX_39502-1004; Component Kind: Standard; Component Type: Standard; Pin Count: 4; Family: Euroblock; Mounted: Yes; Socket: No; SMD: No; Sense: No; Status: None; ComponentHeight: 6.9mm; Author: LNLS DIG AFG; CreateDate: 09/07/2020; LatestRevisionDate: 09/07/2020
L4 L5 = IND_1.5uH_20%_PULSE_PA4342.152NLT: High Current Molded Power Inductor; Manufacturer: PULSE; Power: 16A; Resistance: 0.004R; Tolerance: ±20%; Part Number: IND_1.5uH_20%_PULSE_PA4342.152NLT; Component Kind: Standard; Component Type: Standard; Pin Count: 2; Value: 1.5uH; Status: None; Manufacturer Part Number: PA4342.152NLT; Mounted: Yes; Socket: No; SMD: Yes; Sense: No; ComponentHeight: 4mm; HelpURL: https://br.mouser.com/datasheet/2/336/P769-1526786.pdf; Author: LNLS DIG AFG; CreateDate: 01/09/2021; LatestRevisionDate: 01/09/2021
L6 L11 = IND0603_MURATA_BLM18AG102SN1D: SMD EMIFIL Suppression Chip Ferrite Bead; Manufacturer: MURATA; Power: 400mA; Resistance: 0.50R; Tolerance: ±25%; Part Number: IND0603_MURATA_BLM18AG102SN1D; Component Kind: Standard; Component Type: Standard; Pin Count: 2; Value: 1K@100MHz; Status: None; Manufacturer Part Number: BLM18AG102SN1D; Case: 0603; Mounted: Yes; Socket: No; SMD: Yes; Sense: No; ComponentHeight: 0.95mm; Author: LNLS DIG GBMB; CreateDate: 03/11/2017; LatestRevisionDate: 03/11/2017
L7 L8 = IND_6.8uH_20%_BOURNS_SRN5040TA-6R8M: SMD Semi-shielded Power Inductor; Manufacturer: BOURNS; Power: 2.5A; Resistance: 0.043R; Tolerance: ±20%; Part Number: IND_6.8uH_20%_BOURNS_SRN5040TA-6R8M; Component Kind: Standard; Component Type: Standard; Pin Count: 2; Value: 6.8uH; Status: None; Manufacturer Part Number: SRN5040TA-6R8M; Mounted: Yes; Socket: No; SMD: Yes; Sense: No; ComponentHeight: 4mm; HelpURL: https://www.bourns.com/docs/product-datasheets/SRN5040TA.pdf; Author: LNLS DIG AFG; CreateDate: 04/09/2020; LatestRevisionDate: 04/09/2020
L9 L10 L13-L15 = IND0805_MURATA_BLM21PG221SN1D: SMD EMIFIL Suppression Chip Ferrite Bead; Manufacturer: MURATA; Power: 2A; Resistance: 0.05R; Tolerance: ±25%; Part Number: IND0805_MURATA_BLM21PG221SN1D; Component Kind: Standard; Component Type: Standard; Pin Count: 2; Value: 220R@100MHz; Status: None; Manufacturer Part Number: BLM21PG221SN1D; Case: 0805; Mounted: Yes; Socket: No; SMD: Yes; Sense: No; ComponentHeight: 1.05mm; HelpURL: \\cern.ch\dfs\Applications\Altium\Datasheets\IND0402_MURATA_BLM21P.pdf; Author: CERN DEM JLC; CreateDate: 25/01/2010; LatestRevisionDate: 25/01/2010
L12 = IND_10uH_20%_BOURNS_SRN5040TA-100M: SMD Semi-shielded Power Inductor; Manufacturer: BOURNS; Power: 2.2A; Resistance: 0.056R; Tolerance: ±20%; Part Number: IND_10uH_20%_BOURNS_SRN5040TA-100M; Component Kind: Standard; Component Type: Standard; Pin Count: 2; Value: 10uH; Status: None; Manufacturer Part Number: SRN5040TA-100M; Mounted: Yes; Socket: No; SMD: Yes; Sense: No; ComponentHeight: 4.1mm; HelpURL: https://www.bourns.com/docs/product-datasheets/SRN5040TA.pdf; Author: LNLS DIG AFG; CreateDate: 29/05/2020; LatestRevisionDate: 31/07/2020
LED4-LED12 = LED_AVAGO_HSMC-C190: High Performance ChipLED; Manufacturer: AVAGO; PressFit: No; Bonding: No; Part Number: LED_AVAGO_HSMC-C190; Component Kind: Standard; Component Type: Standard; Color: Red; PackageDescription: Chip Red LED, 2-Leads, Body 1.6x0.8mm, IPC Medium Density; Manufacturer Part Number: HSMC-C190; Pin Count: 2; Mounted: Yes; Socket: No; SMD: Yes; Sense: No; ComponentHeight: 0.8mm; Author: LNLS DIG AFG; CreateDate: 04/09/2020; LatestRevisionDate: 04/09/2020
R45 R52 R73 R76 = R0402_1K_1%_0.0625W_100PPM: General Purpose Thick Film Chip Resistor; Manufacturer: GENERIC; Manufacturer1 Part Number: 232270671002L; TC: ±100ppm/°C; Tolerance: ±1%; Part Number: R0402_1K_1%_0.0625W_100PPM; Component Kind: Standard; Component Type: Standard; Pin Count: 2; Value: 1k; Status: Not recommended; Power: 0.0625W; Manufacturer Part Number: R0402_1K_1%_0.0625W_100PPM; Case: 0402; Mounted: Yes; Sense: No; Socket: No; SMD: Yes; Manufacturer1 Example: YAGEO PHYCOMP; Manufacturer1 ComponentHeight: 0.4mm; HelpURL: \\cern.ch\dfs\Applications\Altium\Datasheets\R0402_Phycomp_RC0402.pdf; Author: CERN DEM JLC; CreateDate: 03/12/2007; LatestRevisionDate: 17/10/2012
R46 R53 = R0402_270K_1%_0.0625W_100PPM: General Purpose Thick Film Chip Resistor; Manufacturer: GENERIC; Manufacturer1 Part Number: 232270672704L; TC: ±100ppm/°C; Tolerance: ±1%; Part Number: R0402_270K_1%_0.0625W_100PPM; Component Kind: Standard; Component Type: Standard; Pin Count: 2; Value: 270k; Status: Not recommended; Power: 0.0625W; Manufacturer Part Number: R0402_270K_1%_0.0625W_100PPM; Case: 0402; Mounted: Yes; Sense: No; Socket: No; SMD: Yes; Manufacturer1 Example: YAGEO PHYCOMP; Manufacturer1 ComponentHeight: 0.4mm; HelpURL: \\cern.ch\dfs\Applications\Altium\Datasheets\R0402_Phycomp_RC0402.pdf; Author: CERN DEM JLC; CreateDate: 03/12/2007; LatestRevisionDate: 17/10/2012
R47 R54 R59 R60 R74 = R0402_6K8_1%_0.0625W_100PPM: General Purpose Thick Film Chip Resistor; Manufacturer: GENERIC; Manufacturer1 Part Number: 232270676802L; TC: ±100ppm/°C; Tolerance: ±1%; Part Number: R0402_6K8_1%_0.0625W_100PPM; Component Kind: Standard; Component Type: Standard; Pin Count: 2; Value: 6k8; Status: Not recommended; Power: 0.0625W; Manufacturer Part Number: R0402_6K8_1%_0.0625W_100PPM; Case: 0402; Mounted: Yes; Sense: No; Socket: No; SMD: Yes; Manufacturer1 Example: YAGEO PHYCOMP; Manufacturer1 ComponentHeight: 0.4mm; HelpURL: \\cern.ch\dfs\Applications\Altium\Datasheets\R0402_Phycomp_RC0402.pdf; Author: CERN DEM JLC; CreateDate: 03/12/2007; LatestRevisionDate: 17/10/2012
R48 R55 = R0805_6K2_1%_0.125W_100PPM: General Purpose Thick Film Chip Resistor; Manufacturer: GENERIC; Manufacturer1 Part Number: NRC10F6201TRF; Power: 0.125W; TC: ±100ppm/°C; Tolerance: ±1%; Part Number: R0805_6K2_1%_0.125W_100PPM; Component Kind: Standard; Component Type: Standard; Pin Count: 2; Value: 6k2; Status: Preferred; Manufacturer Part Number: R0805_6K2_1%_0.125W_100PPM; Case: 0805; Mounted: Yes; Sense: No; Socket: No; SMD: Yes; Manufacturer1 Example: NIC COMPONENT; Manufacturer1 ComponentHeight: 0.6mm; HelpURL: \\cern.ch\dfs\Applications\Altium\Datasheets\R0805_NIC_NRC.pdf; Author: CERN DEM JLC; CreateDate: 03/12/2007; LatestRevisionDate: 13/03/2008
R49 R56 = R0402_100K_1%_0.0625W_100PPM: General Purpose Thick Film Chip Resistor; Manufacturer: GENERIC; Manufacturer1 Part Number: 232270671004L; TC: ±100ppm/°C; Tolerance: ±1%; Part Number: R0402_100K_1%_0.0625W_100PPM; Component Kind: Standard; Component Type: Standard; Pin Count: 2; Value: 100k; Status: Not recommended; Power: 0.0625W; Manufacturer Part Number: R0402_100K_1%_0.0625W_100PPM; Case: 0402; Mounted: Yes; Sense: No; Socket: No; SMD: Yes; Manufacturer1 Example: YAGEO PHYCOMP; Manufacturer1 ComponentHeight: 0.4mm; HelpURL: \\cern.ch\dfs\Applications\Altium\Datasheets\R0402_Phycomp_RC0402.pdf; Author: CERN DEM JLC; CreateDate: 03/12/2007; LatestRevisionDate: 17/10/2012
R50 = R0402_110K_1%_0.0625W_100PPM: General Purpose Thick Film Chip Resistor; Manufacturer: GENERIC; Manufacturer1 Part Number: 232270671104L; TC: ±100ppm/°C; Tolerance: ±1%; Part Number: R0402_110K_1%_0.0625W_100PPM; Component Kind: Standard; Component Type: Standard; Pin Count: 2; Value: 110k; Status: Not recommended; Power: 0.0625W; Manufacturer Part Number: R0402_110K_1%_0.0625W_100PPM; Case: 0402; Mounted: Yes; Sense: No; Socket: No; SMD: Yes; Manufacturer1 Example: YAGEO PHYCOMP; Manufacturer1 ComponentHeight: 0.4mm; HelpURL: \\cern.ch\dfs\Applications\Altium\Datasheets\R0402_Phycomp_RC0402.pdf; Author: CERN DEM JLC; CreateDate: 03/12/2007; LatestRevisionDate: 17/10/2012
R51 R57 = R0805_1K2_1%_0.125W_100PPM: General Purpose Thick Film Chip Resistor; Manufacturer: GENERIC; Manufacturer1 Part Number: NRC10F1201TRF; Power: 0.125W; TC: ±100ppm/°C; Tolerance: ±1%; Part Number: R0805_1K2_1%_0.125W_100PPM; Component Kind: Standard; Component Type: Standard; Pin Count: 2; Value: 1k2; Status: Preferred; Manufacturer Part Number: R0805_1K2_1%_0.125W_100PPM; Case: 0805; Mounted: Yes; Sense: No; Socket: No; SMD: Yes; Manufacturer1 Example: NIC COMPONENT; Manufacturer1 ComponentHeight: 0.6mm; HelpURL: \\cern.ch\dfs\Applications\Altium\Datasheets\R0805_NIC_NRC.pdf; Author: CERN DEM JLC; CreateDate: 03/12/2007; LatestRevisionDate: 13/03/2008
R58 R67 = R0402_36K_1%_0.0625W_100PPM: General Purpose Thick Film Chip Resistor; Manufacturer: GENERIC; Manufacturer1 Part Number: 232270673603L; TC: ±100ppm/°C; Tolerance: ±1%; Part Number: R0402_36K_1%_0.0625W_100PPM; Component Kind: Standard; Component Type: Standard; Pin Count: 2; Value: 36k; Status: Not recommended; Power: 0.0625W; Manufacturer Part Number: R0402_36K_1%_0.0625W_100PPM; Case: 0402; Mounted: Yes; Sense: No; Socket: No; SMD: Yes; Manufacturer1 Example: YAGEO PHYCOMP; Manufacturer1 ComponentHeight: 0.4mm; HelpURL: \\cern.ch\dfs\Applications\Altium\Datasheets\R0402_Phycomp_RC0402.pdf; Author: CERN DEM JLC; CreateDate: 03/12/2007; LatestRevisionDate: 17/10/2012
R61 R62 = R0805_18K_1%_0.125W_100PPM: General Purpose Thick Film Chip Resistor; Manufacturer: GENERIC; Manufacturer1 Part Number: NRC10F1802TRF; Power: 0.125W; TC: ±100ppm/°C; Tolerance: ±1%; Part Number: R0805_18K_1%_0.125W_100PPM; Component Kind: Standard; Component Type: Standard; Pin Count: 2; Value: 18k; Status: Preferred; Manufacturer Part Number: R0805_18K_1%_0.125W_100PPM; Case: 0805; Mounted: Yes; Sense: No; Socket: No; SMD: Yes; Manufacturer1 Example: NIC COMPONENT; Manufacturer1 ComponentHeight: 0.6mm; HelpURL: \\cern.ch\dfs\Applications\Altium\Datasheets\R0805_NIC_NRC.pdf; Author: CERN DEM JLC; CreateDate: 03/12/2007; LatestRevisionDate: 13/03/2008
R63 = R0402_7K5_1%_0.0625W_100PPM: General Purpose Thick Film Chip Resistor; Manufacturer: GENERIC; Manufacturer1 Part Number: 232270677502L; TC: ±100ppm/°C; Tolerance: ±1%; Part Number: R0402_7K5_1%_0.0625W_100PPM; Component Kind: Standard; Component Type: Standard; Pin Count: 2; Value: 7k5; Status: Not recommended; Power: 0.0625W; Manufacturer Part Number: R0402_7K5_1%_0.0625W_100PPM; Case: 0402; Mounted: Yes; Sense: No; Socket: No; SMD: Yes; Manufacturer1 Example: YAGEO PHYCOMP; Manufacturer1 ComponentHeight: 0.4mm; HelpURL: \\cern.ch\dfs\Applications\Altium\Datasheets\R0402_Phycomp_RC0402.pdf; Author: CERN DEM JLC; CreateDate: 03/12/2007; LatestRevisionDate: 17/10/2012
R64 = R0402_20K5_1%_0.0625W_100PPM: General Purpose Thick Film Chip Resistor; Manufacturer: GENERIC; Manufacturer1 Part Number: RC0402FR-0720K5L; Power: 0.1W; TC: ±100ppm/°C; Tolerance: ±1%; Part Number: R0402_20K5_1%_0.0625W_100PPM; Component Kind: Standard; Component Type: Standard; Pin Count: 2; Value: 20k5; Status: None; Manufacturer Part Number: R0402_20K5_1%_0.0625W_100PPM; Case: 0402; Mounted: Yes; Sense: No; Socket: No; SMD: Yes; Manufacturer1 Example: YAGEO; Manufacturer1 ComponentHeight: 0.4mm; Author: LNLS GCA AFG; CreateDate: 01/10/2021; LatestRevisionDate: 01/10/2021
R65 R66 = R0805_9K1_1%_0.125W_100PPM: General Purpose Thick Film Chip Resistor; Manufacturer: GENERIC; Manufacturer1 Part Number: NRC10F9101TRF; Power: 0.125W; TC: ±100ppm/°C; Tolerance: ±1%; Part Number: R0805_9K1_1%_0.125W_100PPM; Component Kind: Standard; Component Type: Standard; Pin Count: 2; Value: 9k1; Status: Preferred; Manufacturer Part Number: R0805_9K1_1%_0.125W_100PPM; Case: 0805; Mounted: Yes; Sense: No; Socket: No; SMD: Yes; Manufacturer1 Example: NIC COMPONENT; Manufacturer1 ComponentHeight: 0.6mm; HelpURL: \\cern.ch\dfs\Applications\Altium\Datasheets\R0805_NIC_NRC.pdf; Author: CERN DEM JLC; CreateDate: 03/12/2007; LatestRevisionDate: 13/03/2008
R68 = R0402_2K_1%_0.0625W_100PPM: General Purpose Thick Film Chip Resistor; Manufacturer: GENERIC; Manufacturer1 Part Number: 232270672002L; TC: ±100ppm/°C; Tolerance: ±1%; Part Number: R0402_2K_1%_0.0625W_100PPM; Component Kind: Standard; Component Type: Standard; Pin Count: 2; Value: 2k; Status: Not recommended; Power: 0.0625W; Manufacturer Part Number: R0402_2K_1%_0.0625W_100PPM; Case: 0402; Mounted: Yes; Sense: No; Socket: No; SMD: Yes; Manufacturer1 Example: YAGEO PHYCOMP; Manufacturer1 ComponentHeight: 0.4mm; HelpURL: \\cern.ch\dfs\Applications\Altium\Datasheets\R0402_Phycomp_RC0402.pdf; Author: CERN DEM JLC; CreateDate: 03/12/2007; LatestRevisionDate: 17/10/2012
R70 = R0402_18K_1%_0.0625W_100PPM: General Purpose Thick Film Chip Resistor; Manufacturer: GENERIC; Manufacturer1 Part Number: 232270671803L; TC: ±100ppm/°C; Tolerance: ±1%; Part Number: R0402_18K_1%_0.0625W_100PPM; Component Kind: Standard; Component Type: Standard; Pin Count: 2; Value: 18k; Status: Not recommended; Power: 0.0625W; Manufacturer Part Number: R0402_18K_1%_0.0625W_100PPM; Case: 0402; Mounted: Yes; Sense: No; Socket: No; SMD: Yes; Manufacturer1 Example: YAGEO PHYCOMP; Manufacturer1 ComponentHeight: 0.4mm; HelpURL: \\cern.ch\dfs\Applications\Altium\Datasheets\R0402_Phycomp_RC0402.pdf; Author: CERN DEM JLC; CreateDate: 03/12/2007; LatestRevisionDate: 17/10/2012
R71 = R0402_43K_1%_0.0625W_100PPM: General Purpose Thick Film Chip Resistor; Manufacturer: GENERIC; Manufacturer1 Part Number: 232270674303L; TC: ±100ppm/°C; Tolerance: ±1%; Part Number: R0402_43K_1%_0.0625W_100PPM; Component Kind: Standard; Component Type: Standard; Pin Count: 2; Value: 43k; Status: Not recommended; Power: 0.0625W; Manufacturer Part Number: R0402_43K_1%_0.0625W_100PPM; Case: 0402; Mounted: Yes; Sense: No; Socket: No; SMD: Yes; Manufacturer1 Example: YAGEO PHYCOMP; Manufacturer1 ComponentHeight: 0.4mm; HelpURL: \\cern.ch\dfs\Applications\Altium\Datasheets\R0402_Phycomp_RC0402.pdf; Author: CERN DEM JLC; CreateDate: 03/12/2007; LatestRevisionDate: 17/10/2012
R72 = R0402_1K8_1%_0.0625W_100PPM: General Purpose Thick Film Chip Resistor; Manufacturer: GENERIC; Manufacturer1 Part Number: 232270671802L; TC: ±100ppm/°C; Tolerance: ±1%; Part Number: R0402_1K8_1%_0.0625W_100PPM; Component Kind: Standard; Component Type: Standard; Pin Count: 2; Value: 1k8; Status: Not recommended; Power: 0.0625W; Manufacturer Part Number: R0402_1K8_1%_0.0625W_100PPM; Case: 0402; Mounted: Yes; Sense: No; Socket: No; SMD: Yes; Manufacturer1 Example: YAGEO PHYCOMP; Manufacturer1 ComponentHeight: 0.4mm; HelpURL: \\cern.ch\dfs\Applications\Altium\Datasheets\R0402_Phycomp_RC0402.pdf; Author: CERN DEM JLC; CreateDate: 03/12/2007; LatestRevisionDate: 17/10/2012
R75 R77 R138 = R0402_1K5_1%_0.0625W_100PPM: General Purpose Thick Film Chip Resistor; Manufacturer: GENERIC; Manufacturer1 Part Number: 232270671502L; TC: ±100ppm/°C; Tolerance: ±1%; Part Number: R0402_1K5_1%_0.0625W_100PPM; Component Kind: Standard; Component Type: Standard; Pin Count: 2; Value: 1k5; Status: Not recommended; Power: 0.0625W; Manufacturer Part Number: R0402_1K5_1%_0.0625W_100PPM; Case: 0402; Mounted: Yes; Sense: No; Socket: No; SMD: Yes; Manufacturer1 Example: YAGEO PHYCOMP; Manufacturer1 ComponentHeight: 0.4mm; HelpURL: \\cern.ch\dfs\Applications\Altium\Datasheets\R0402_Phycomp_RC0402.pdf; Author: CERN DEM JLC; CreateDate: 03/12/2007; LatestRevisionDate: 17/10/2012
R78 = R0402_8K2_1%_0.0625W_100PPM: General Purpose Thick Film Chip Resistor; Manufacturer: GENERIC; Manufacturer1 Part Number: 232270678202L; TC: ±100ppm/°C; Tolerance: ±1%; Part Number: R0402_8K2_1%_0.0625W_100PPM; Component Kind: Standard; Component Type: Standard; Pin Count: 2; Value: 8k2; Status: Not recommended; Power: 0.0625W; Manufacturer Part Number: R0402_8K2_1%_0.0625W_100PPM; Case: 0402; Mounted: Yes; Sense: No; Socket: No; SMD: Yes; Manufacturer1 Example: YAGEO PHYCOMP; Manufacturer1 ComponentHeight: 0.4mm; HelpURL: \\cern.ch\dfs\Applications\Altium\Datasheets\R0402_Phycomp_RC0402.pdf; Author: CERN DEM JLC; CreateDate: 03/12/2007; LatestRevisionDate: 17/10/2012
R139 = R0805_3R3_1%_0.125W_200PPM: General Purpose Thick Film Chip Resistor; Manufacturer: GENERIC; Manufacturer1 Part Number: 232273463308L or RC0805FR-073R3L; Power: 0.125W; TC: ±200ppm/°C; Tolerance: ±1%; Part Number: R0805_3R3_1%_0.125W_200PPM; Component Kind: Standard; Component Type: Standard; Pin Count: 2; Value: 3R3; Status: Preferred; Manufacturer Part Number: R0805_3R3_1%_0.125W_200PPM; Case: 0805; Mounted: Yes; Sense: No; Socket: No; SMD: Yes; Manufacturer1 Example: YAGEO PHYCOMP; Manufacturer1 ComponentHeight: 0.65mm; HelpURL: \\cern.ch\dfs\Applications\Altium\Datasheets\R0805_Phycomp_RC0805.pdf; Author: CERN DEM JLC; CreateDate: 03/12/2007; LatestRevisionDate: 17/10/2012
R141 R142 = R0402_2K4_1%_0.0625W_100PPM: General Purpose Thick Film Chip Resistor; Manufacturer: GENERIC; Manufacturer1 Part Number: 232270672402L; TC: ±100ppm/°C; Tolerance: ±1%; Part Number: R0402_2K4_1%_0.0625W_100PPM; Component Kind: Standard; Component Type: Standard; Pin Count: 2; Value: 2k4; Status: Not recommended; Power: 0.0625W; Manufacturer Part Number: R0402_2K4_1%_0.0625W_100PPM; Case: 0402; Mounted: Yes; Sense: No; Socket: No; SMD: Yes; Manufacturer1 Example: YAGEO PHYCOMP; Manufacturer1 ComponentHeight: 0.4mm; HelpURL: \\cern.ch\dfs\Applications\Altium\Datasheets\R0402_Phycomp_RC0402.pdf; Author: CERN DEM JLC; CreateDate: 03/12/2007; LatestRevisionDate: 17/10/2012
R143 R144 = R0402_1K3_1%_0.0625W_100PPM: General Purpose Thick Film Chip Resistor; Manufacturer: GENERIC; Manufacturer1 Part Number: 232270671302L; TC: ±100ppm/°C; Tolerance: ±1%; Part Number: R0402_1K3_1%_0.0625W_100PPM; Component Kind: Standard; Component Type: Standard; Pin Count: 2; Value: 1k3; Status: Not recommended; Power: 0.0625W; Manufacturer Part Number: R0402_1K3_1%_0.0625W_100PPM; Case: 0402; Mounted: Yes; Sense: No; Socket: No; SMD: Yes; Manufacturer1 Example: YAGEO PHYCOMP; Manufacturer1 ComponentHeight: 0.4mm; HelpURL: \\cern.ch\dfs\Applications\Altium\Datasheets\R0402_Phycomp_RC0402.pdf; Author: CERN DEM JLC; CreateDate: 03/12/2007; LatestRevisionDate: 17/10/2012
R145 = R0402_820R_1%_0.0625W_100PPM: General Purpose Thick Film Chip Resistor; Manufacturer: GENERIC; Manufacturer1 Part Number: 232270678201L; TC: ±100ppm/°C; Tolerance: ±1%; Part Number: R0402_820R_1%_0.0625W_100PPM; Component Kind: Standard; Component Type: Standard; Pin Count: 2; Value: 820; Status: Not recommended; Power: 0.0625W; Manufacturer Part Number: R0402_820R_1%_0.0625W_100PPM; Case: 0402; Mounted: Yes; Sense: No; Socket: No; SMD: Yes; Manufacturer1 Example: YAGEO PHYCOMP; Manufacturer1 ComponentHeight: 0.4mm; HelpURL: \\cern.ch\dfs\Applications\Altium\Datasheets\R0402_Phycomp_RC0402.pdf; Author: CERN DEM JLC; CreateDate: 03/12/2007; LatestRevisionDate: 17/10/2012
R146 R147 = R0402_470R_1%_0.0625W_100PPM: General Purpose Thick Film Chip Resistor; Manufacturer: GENERIC; Manufacturer1 Part Number: 232270674701L; TC: ±100ppm/°C; Tolerance: ±1%; Part Number: R0402_470R_1%_0.0625W_100PPM; Component Kind: Standard; Component Type: Standard; Pin Count: 2; Value: 470; Status: Not recommended; Power: 0.0625W; Manufacturer Part Number: R0402_470R_1%_0.0625W_100PPM; Case: 0402; Mounted: Yes; Sense: No; Socket: No; SMD: Yes; Manufacturer1 Example: YAGEO PHYCOMP; Manufacturer1 ComponentHeight: 0.4mm; HelpURL: \\cern.ch\dfs\Applications\Altium\Datasheets\R0402_Phycomp_RC0402.pdf; Author: CERN DEM JLC; CreateDate: 03/12/2007; LatestRevisionDate: 17/10/2012
R148 = R0402_330R_1%_0.0625W_100PPM: General Purpose Thick Film Chip Resistor; Manufacturer: GENERIC; Manufacturer1 Part Number: 232270673301L; TC: ±100ppm/°C; Tolerance: ±1%; Part Number: R0402_330R_1%_0.0625W_100PPM; Component Kind: Standard; Component Type: Standard; Pin Count: 2; Value: 330; Status: Not recommended; Power: 0.0625W; Manufacturer Part Number: R0402_330R_1%_0.0625W_100PPM; Case: 0402; Mounted: Yes; Sense: No; Socket: No; SMD: Yes; Manufacturer1 Example: YAGEO PHYCOMP; Manufacturer1 ComponentHeight: 0.4mm; HelpURL: \\cern.ch\dfs\Applications\Altium\Datasheets\R0402_Phycomp_RC0402.pdf; Author: CERN DEM JLC; CreateDate: 03/12/2007; LatestRevisionDate: 17/10/2012
R149 = R0402_150R_1%_0.0625W_100PPM: General Purpose Thick Film Chip Resistor; Manufacturer: GENERIC; Manufacturer1 Part Number: 232270671501L; TC: ±100ppm/°C; Tolerance: ±1%; Part Number: R0402_150R_1%_0.0625W_100PPM; Component Kind: Standard; Component Type: Standard; Pin Count: 2; Value: 150; Status: Not recommended; Power: 0.0625W; Manufacturer Part Number: R0402_150R_1%_0.0625W_100PPM; Case: 0402; Mounted: Yes; Sense: No; Socket: No; SMD: Yes; Manufacturer1 Example: YAGEO PHYCOMP; Manufacturer1 ComponentHeight: 0.4mm; HelpURL: \\cern.ch\dfs\Applications\Altium\Datasheets\R0402_Phycomp_RC0402.pdf; Author: CERN DEM JLC; CreateDate: 03/12/2007; LatestRevisionDate: 17/10/2012
T1 T2 = BSG0811ND: 25V, 50A Dual N-Channel OptiMOS MOSFET; Manufacturer: Infineon; PressFit: No; Bonding: No; Part Number: BSG0811ND; Component Kind: Standard; Component Type: Standard; Device: BSG0811ND; PackageDescription: PG-TISON8-4 10-Leads, Pitch 1.27mm - Body 5.0x6.0mm, IPC Medium Density; Manufacturer Part Number: BSG0811ND; Pin Count: 10; Case: PG-TISON8-4; Mounted: Yes; Socket: No; SMD: Yes; Sense: No; ComponentHeight: 1mm; Author: LNLS DIG AFG; CreateDate: 21/05/2020; LatestRevisionDate: 21/05/2020